# Altium schematic sheet e3_tp1_ej1.SchDoc
size A
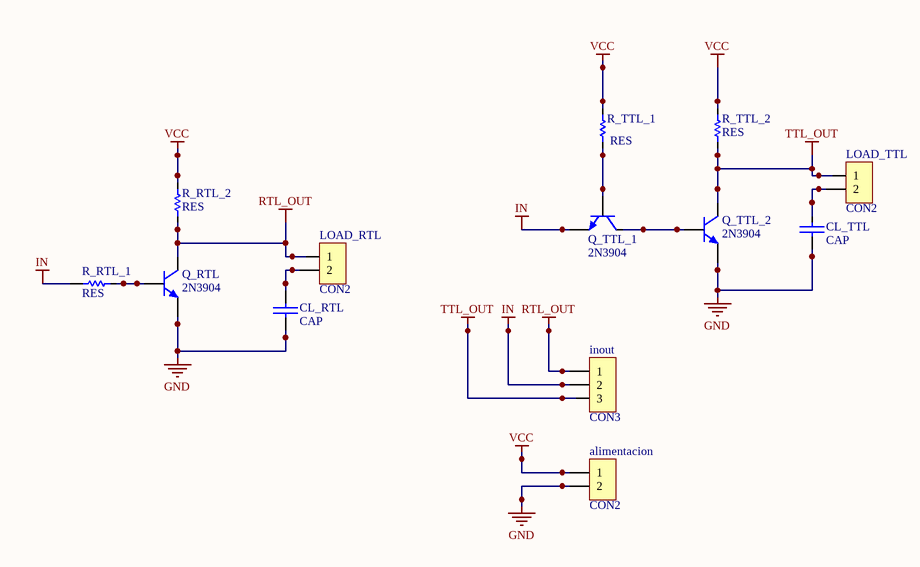
[diagram p0: e3_tp1_ej1.SchDoc]

## Parts
alimentacion  CON2  [SIP2]
CL_RTL  CAP  [CAP200]
CL_TTL  CAP  [CAP200]
inout  CON3  [SIP3]
LOAD_RTL  CON2  [SIP2]
LOAD_TTL  CON2  [SIP2]
Q_RTL  2N3904  [TO-92A]
Q_TTL_1  2N3904  [TO-92A]
Q_TTL_2  2N3904  [TO-92A]
R_RTL_1  RES  [RES300]
R_RTL_2  RES  [RES300]
R_TTL_1  RES  [RES300]
R_TTL_2  RES  [RES300]

## Nets
GND: alimentacion.2 CL_RTL.2 CL_TTL.2 Q_RTL.1(E) Q_TTL_2.1(E)
IN: inout.2 Q_TTL_1.1(E) R_RTL_1.1
RTL_OUT: inout.1 LOAD_RTL.1 Q_RTL.3(C) R_RTL_2.1
TTL_OUT: inout.3 LOAD_TTL.1 Q_TTL_2.3(C) R_TTL_2.1
VCC: alimentacion.1 R_RTL_2.2 R_TTL_1.2 R_TTL_2.2
NetCL_RTL_1: CL_RTL.1 LOAD_RTL.2
NetCL_TTL_1: CL_TTL.1 LOAD_TTL.2
NetQ_RTL_2: Q_RTL.2(B) R_RTL_1.2
NetQ_TTL_1_2: Q_TTL_1.2(B) R_TTL_1.1
NetQ_TTL_1_3: Q_TTL_1.3(C) Q_TTL_2.2(B)

## Library data of the parts
Q_RTL Q_TTL_1 Q_TTL_2 = 2N3904: NPN General Purpose Amplifier; Published: 8-Jun-2000; LatestRevisionDate: 15-Jan-2003; LatestRevisionNote: PCB Footprint 'BCY-W3/D4.7' replaced; DatasheetVersion: 1997; PackageVersion: Sep-1998; PackageReference: TO-92A; Publisher: Altium Limited; PackageDescription: TO, Flat Index; 3 In-Line, Axial Leads; Body Dia. 4.5mm; Leads 0.51 x 0.48 mm (max); ComponentLink1Description: Manufacturer Link; ComponentLink1URL: http://www.fairchildsemi.com/; ComponentLink2Description: Datasheet; ComponentLink2URL: http://www.fairchildsemi.com/ds/2N%2F2N3904.pdf